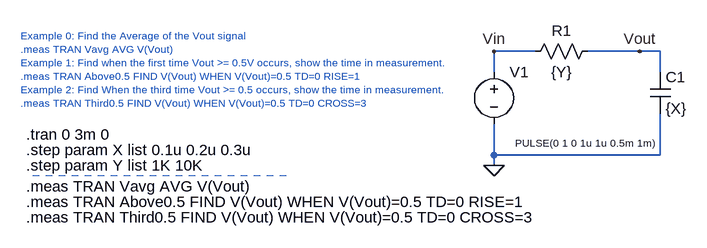
[diagram p0: schematic 04-Meas.asc]
04-Meas.asc, the LTspice schematic file:
Version 4
SHEET 1 932 680
WIRE 128 96 64 96
WIRE 288 96 208 96
WIRE 320 96 288 96
WIRE 64 128 64 96
WIRE 320 128 320 96
WIRE 64 256 64 208
WIRE 320 256 320 192
WIRE 320 256 64 256
WIRE 64 272 64 256
FLAG 64 96 Vin
FLAG 288 96 Vout
FLAG 64 272 0
SYMBOL voltage 64 112 R0
WINDOW 3 244 125 Right 1
WINDOW 123 0 0 Left 0
WINDOW 39 0 0 Left 0
SYMATTR Value PULSE(0 1 0 1u 1u 0.5m 1m)
SYMATTR InstName V1
SYMBOL res 224 80 R90
WINDOW 0 0 56 VBottom 2
WINDOW 3 32 56 VTop 2
SYMATTR InstName R1
SYMATTR Value {Y}
SYMBOL cap 304 128 R0
SYMATTR InstName C1
SYMATTR Value {X}
TEXT -656 224 Left 2 !.tran 0 3m 0
TEXT -656 248 Left 2 !.step param X list 0.1u 0.2u 0.3u
TEXT -656 272 Left 2 !.step param Y list 1K 10K
TEXT -656 328 Left 2 !.meas TRAN Above0.5 FIND V(Vout) WHEN V(Vout)=0.5 TD=0 RISE=1
TEXT -664 72 Left 1 ;Example 0: Find the Average of the Vout signal\n.meas TRAN Vavg AVG V(Vout)\nExample 1: Find when the first time Vout >= 0.5V occurs, show the time in measurement.\n.meas TRAN Above0.5 FIND V(Vout) WHEN V(Vout)=0.5 TD=0 RISE=1\nExample 2: Find When the third time Vout >= 0.5 occurs, show the time in measurement.\n.meas TRAN Third0.5 FIND V(Vout) WHEN V(Vout)=0.5 TD=0 CROSS=3
TEXT -656 304 Left 2 !.meas TRAN Vavg AVG V(Vout)
TEXT -656 352 Left 2 !.meas TRAN Third0.5 FIND V(Vout) WHEN V(Vout)=0.5 TD=0 CROSS=3
LINE Normal -256 288 -656 288 2
LINE Normal -256 288 -256 288 2

The netlist it stands for:
* 04-Meas.asc
V1 Vin 0 PULSE(0 1 0 1u 1u 0.5m 1m)
R1 Vout Vin {Y}
C1 Vout 0 {X}
.tran 0 3m 0
.step param X list 0.1u 0.2u 0.3u
.step param Y list 1K 10K
.meas TRAN Above0.5 FIND V(Vout) WHEN V(Vout)=0.5 TD=0 RISE=1
* Example 0: Find the Average of the Vout signal
* .meas TRAN Vavg AVG V(Vout)
* Example 1: Find when the first time Vout >= 0.5V occurs, show the time in measurement.
* .meas TRAN Above0.5 FIND V(Vout) WHEN V(Vout)=0.5 TD=0 RISE=1
* Example 2: Find When the third time Vout >= 0.5 occurs, show the time in measurement.
* .meas TRAN Third0.5 FIND V(Vout) WHEN V(Vout)=0.5 TD=0 CROSS=3
.meas TRAN Vavg AVG V(Vout)
.meas TRAN Third0.5 FIND V(Vout) WHEN V(Vout)=0.5 TD=0 CROSS=3
.backanno
.end